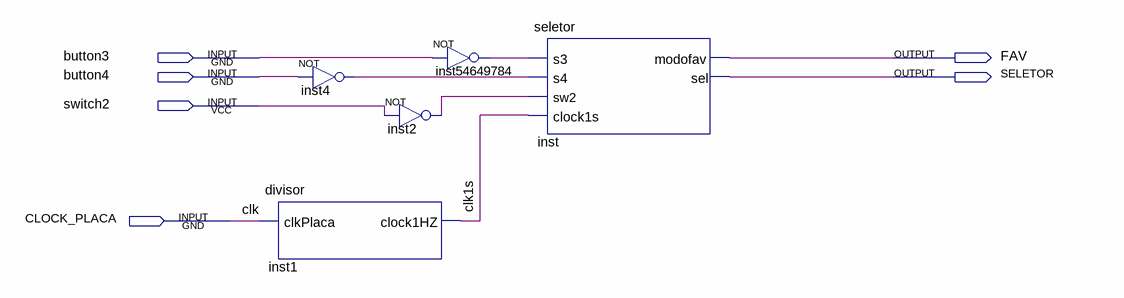
[diagram p0: schematic sheet]
// Quartus schematic TESTESELETOR.bdf as structural Verilog: 5 symbols, 6 pins
module TESTESELETOR (
  input  button3,
  input  button4,
  input  switch2,
  input  CLOCK_PLACA,
  output FAV,
  output SELETOR
);

  wire clk1s, inst2_out, inst4_out, inst54649784_out;

  divisor inst1 (.clkPlaca(CLOCK_PLACA), .clock1HZ(clk1s));
  not inst4 (inst4_out, button4);
  not inst2 (inst2_out, switch2);
  not inst54649784 (inst54649784_out, button3);
  seletor inst (.s3(inst54649784_out), .s4(inst4_out), .sw2(inst2_out), .clock1s(clk1s), .modofav(FAV), .sel(SELETOR));

  // Other names for the same wires on the sheet: clk = CLOCK_PLACA
endmodule
